# EAGLE design LPC1100_dev (EAGLE 6.2)
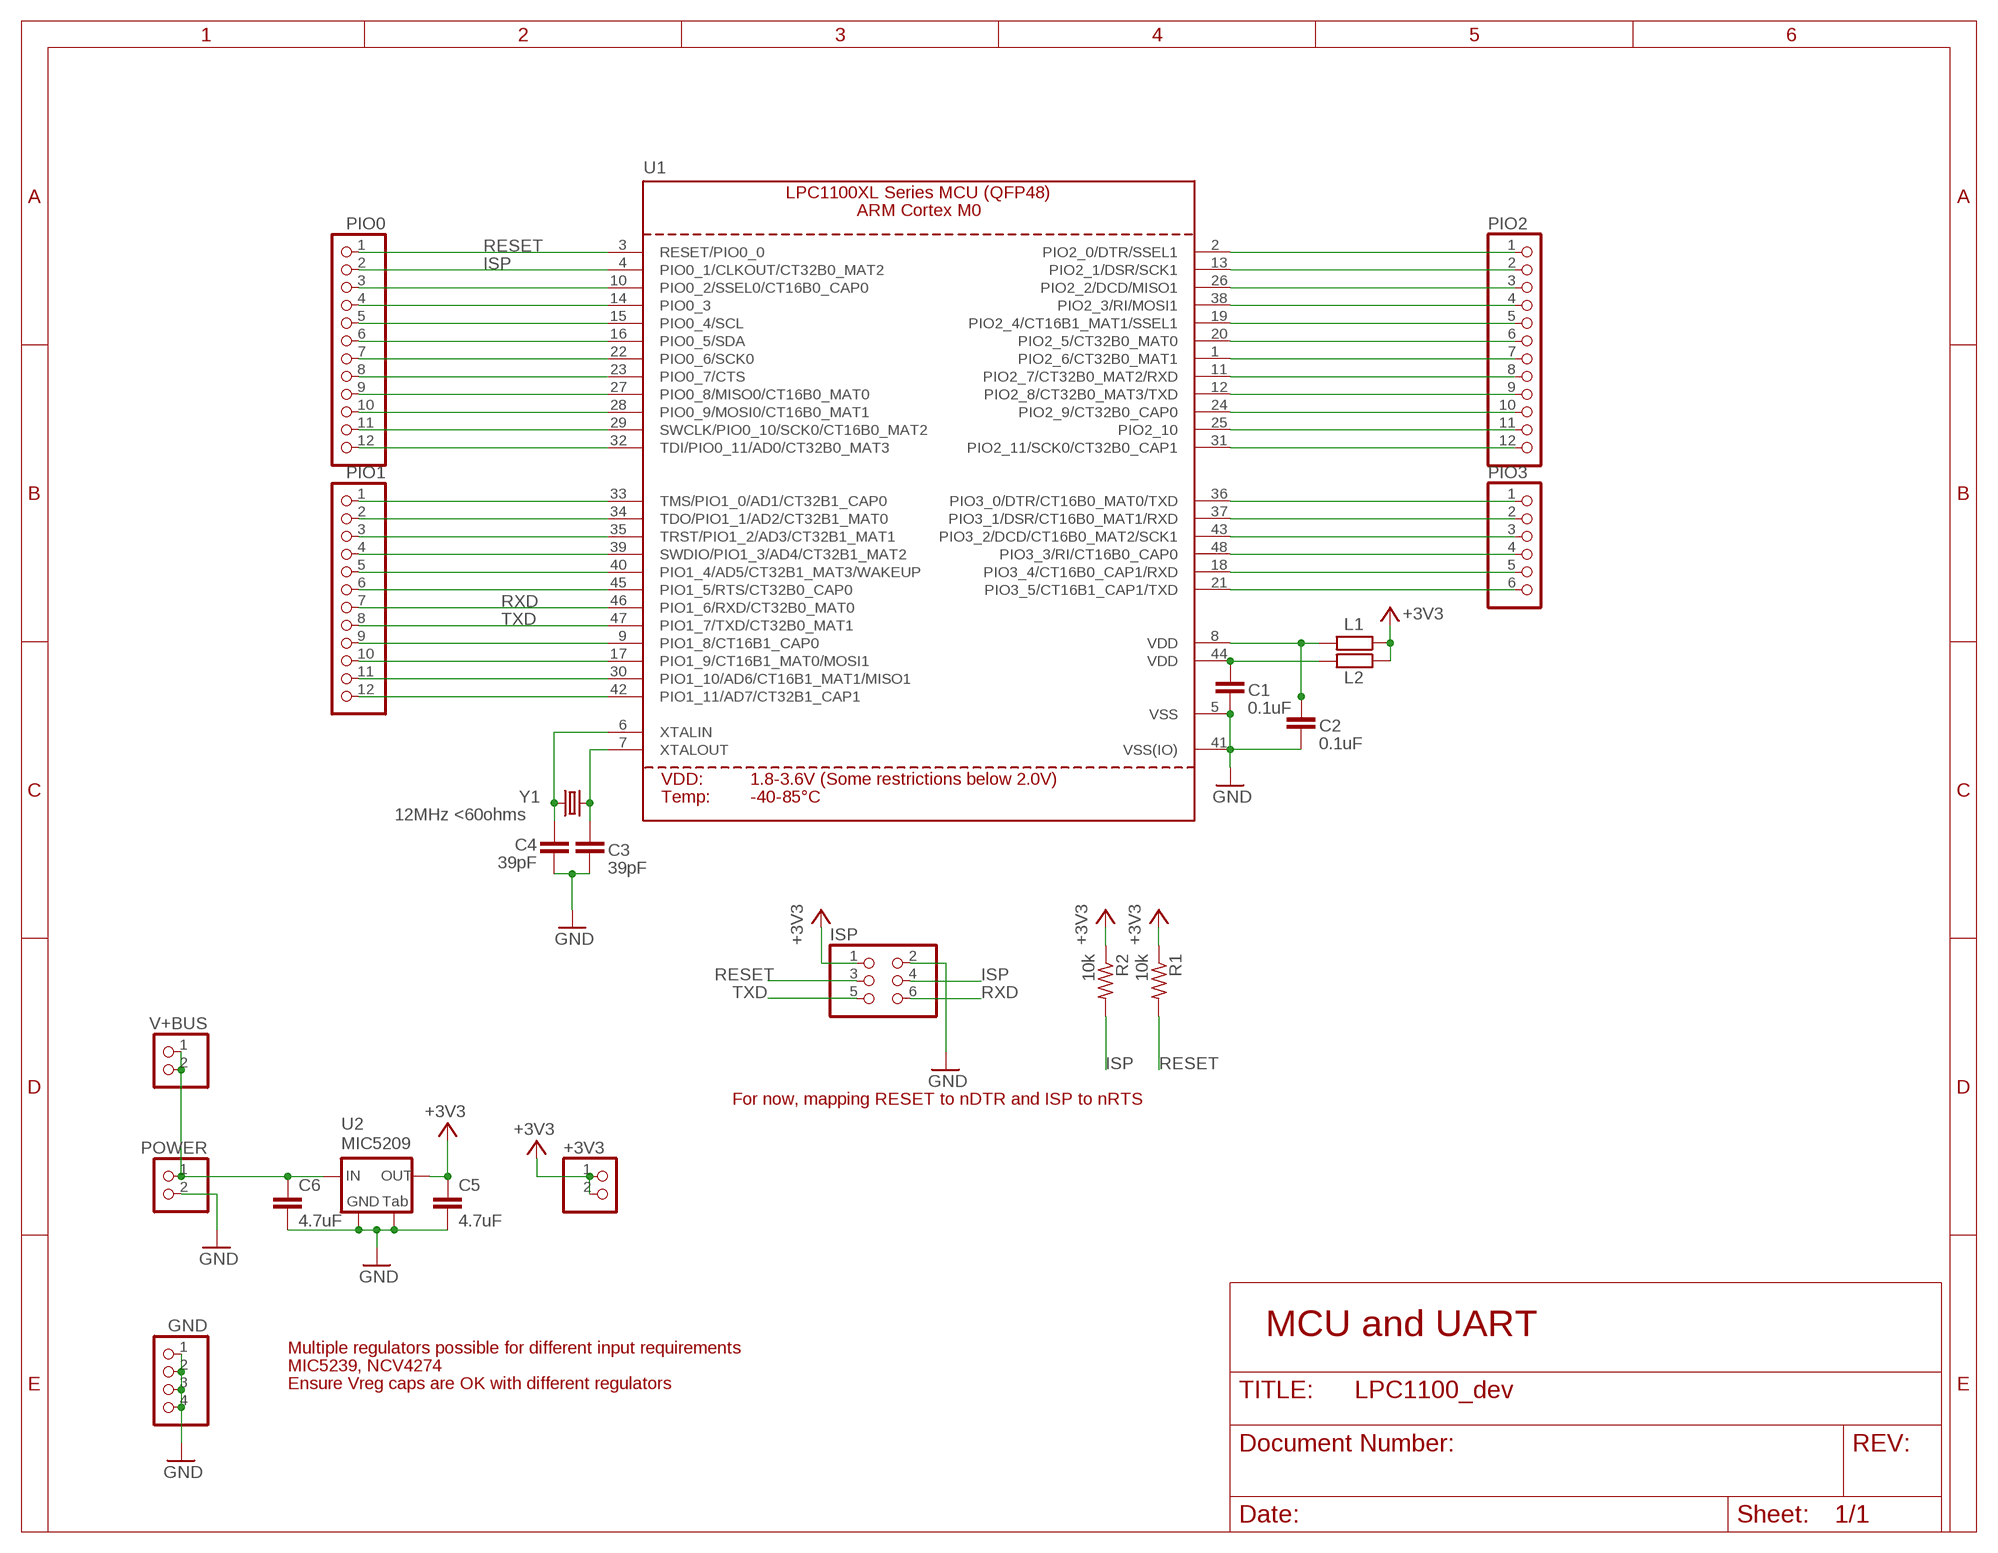
[diagram p0: schematic, sheet 1]

## Parts
+3V3  PINHD-1X2  [1X02]
C1  0.1uF  C-EUC0603  [C0603]
C2  0.1uF  C-EUC0603  [C0603]
C3  39pF  C-EUC0603  [C0603]
C4  39pF  C-EUC0603  [C0603]
C5  4.7uF  C-EUC1210  [C1210]
C6  4.7uF  C-EUC1210  [C1210]
GND  PINHD-1X4  [1X04]
ISP  PINHD-2X3  [2X03]
L1  R-EU_R0603  [R0603]
L2  R-EU_R0603  [R0603]
PIO0  PINHD-1X12  [1X12]
PIO1  PINHD-1X12  [1X12]
PIO2  PINHD-1X12  [1X12]
PIO3  PINHD-1X6  [1X06]
POWER  PINHD-1X2  [1X02]
R1  10k  R-US_R0603  [R0603]
R2  10k  R-US_R0603  [R0603]
U1  LPC1113/4/5_QFP48_XLSERIES  [LQFP48]
U2  MIC5209  MIC5239  [SOT223]
V+BUS  PINHD-1X2  [1X02]
Y1  12MHz <60ohms  CRYSTALHC49S  [HC49/S]

## Nets
+3V3: +3V3.1 +3V3.2 C5.1 ISP.1 L1.1 L2.1 R1.1 R2.1 U2.3(OUT)
CHARGE: PIO0.8 U1.23(PIO0_7/CTS)
DDS_FSYNC: PIO0.3 U1.10(PIO0_2/SSEL0/CT16B0_CAP0)
DDS_MCLK: PIO0.9 U1.27(PIO0_8/MISO0/CT16B0_MAT0)
DDS_SCLK: PIO0.11 U1.29(SWCLK/PIO0_10/SCK0/CT16B0_MAT2)
DDS_SDATA: PIO0.10 U1.28(PIO0_9/MOSI0/CT16B0_MAT1)
FAULT: PIO1.10 U1.17(PIO1_9/CT16B1_MAT0/MOSI1)
GND: C1.2 C2.2 C3.2 C4.2 C5.2 C6.2 GND.1 GND.2 GND.3 GND.4 ISP.2 POWER.2 U1.5(VSS) U1.41(VSS(IO)) U2.2(GND) U2.4(TAB)
ISP: ISP.4 PIO0.2 R2.2 U1.4(PIO0_1/CLKOUT/CT32B0_MAT2)
MEGGER_GAIN: PIO2.12 U1.31(PIO2_11/SCK0/CT32B0_CAP1)
MEGGER_I: PIO1.11 U1.30(PIO1_10/AD6/CT16B1_MAT1/MISO1)
MEGGER_V: PIO0.12 U1.32(TDI/PIO0_11/AD0/CT32B0_MAT3)
N$1: PIO0.5 U1.15(PIO0_4/SCL)
N$2: C6.1 POWER.1 U2.1(IN) V+BUS.1 V+BUS.2
N$3: PIO0.6 U1.16(PIO0_5/SDA)
N$4: PIO1.9 U1.9(PIO1_8/CT16B1_CAP0)
N$5: PIO2.1 U1.2(PIO2_0/DTR/SSEL1)
N$6: PIO2.4 U1.38(PIO2_3/RI/MOSI1)
N$7: PIO2.5 U1.19(PIO2_4/CT16B1_MAT1/SSEL1)
N$8: PIO2.10 U1.24(PIO2_9/CT32B0_CAP0)
N$9: PIO2.11 U1.25(PIO2_10)
N$10: PIO3.1 U1.36(PIO3_0/DTR/CT16B0_MAT0/TXD)
N$11: PIO3.3 U1.43(PIO3_2/DCD/CT16B0_MAT2/SCK1)
N$12: PIO3.4 U1.48(PIO3_3/RI/CT16B0_CAP0)
N$13: PIO3.5 U1.18(PIO3_4/CT16B0_CAP1/RXD)
N$14: PIO3.6 U1.21(PIO3_5/CT16B1_CAP1/TXD)
N$72: C3.1 U1.7(XTALOUT) Y1.2
N$73: C4.1 U1.6(XTALIN) Y1.1
N$118: C1.1 L2.2 U1.44(VDD)
N$119: C2.1 L1.2 U1.8(VDD)
N$121: PIO3.2 U1.37(PIO3_1/DSR/CT16B0_MAT1/RXD)
N$122: PIO2.7 U1.1(PIO2_6/CT32B0_MAT1)
N$123: PIO1.6 U1.45(PIO1_5/RTS/CT32B0_CAP0)
PEAK_RESET: PIO1.2 U1.34(TDO/PIO1_1/AD2/CT32B1_MAT0)
PHONE_MUX_DATA: PIO2.8 U1.11(PIO2_7/CT32B0_MAT2/RXD)
PHONE_MUX_LATCH: PIO2.9 U1.12(PIO2_8/CT32B0_MAT3/TXD)
PHONE_MUX_OE: PIO0.4 U1.14(PIO0_3)
PHONE_MUX_SCK: PIO2.2 U1.13(PIO2_1/DSR/SCK1)
RESET: ISP.3 PIO0.1 R1.2 U1.3(RESET/PIO0_0)
RXD: ISP.6 PIO1.7 U1.46(PIO1_6/RXD/CT32B0_MAT0)
TXD: ISP.5 PIO1.8 U1.47(PIO1_7/TXD/CT32B0_MAT1)
VR_POL: PIO1.12 U1.42(PIO1_11/AD7/CT32B1_CAP1)
VX_POL: PIO1.1 U1.33(TMS/PIO1_0/AD1/CT32B1_CAP0)
Z_DC_SELECT: PIO2.3 U1.26(PIO2_2/DCD/MISO1)
Z_I: PIO1.4 U1.39(SWDIO/PIO1_3/AD4/CT32B1_MAT2)
Z_I_GAIN: PIO1.5 U1.40(PIO1_4/AD5/CT32B1_MAT3/WAKEUP)
Z_MEG_MUX: PIO0.7 U1.22(PIO0_6/SCK0)
Z_SHDN: PIO2.6 U1.20(PIO2_5/CT32B0_MAT0)
Z_V: PIO1.3 U1.35(TRST/PIO1_2/AD3/CT32B1_MAT1)

## Notes on the sheet
- For now, mapping RESET to nDTR and ISP to nRTS
- MCU and UART
- Multiple regulators possible for different input requirements
- MIC5239, NCV4274
- Ensure Vreg caps are OK with different regulators

## Library data of the parts
+3V3 POWER V+BUS = pinhead:PINHD-1X2: PIN HEADER
C1-C6 = rcl:C-EU: CAPACITOR, European symbol
GND = pinhead:PINHD-1X4: PIN HEADER
ISP = pinhead:PINHD-2X3: PIN HEADER
L1 L2 = rcl:R-EU_: RESISTOR, European symbol
PIO0 PIO1 PIO2 = pinhead:PINHD-1X12: PIN HEADER
PIO3 = pinhead:PINHD-1X6: PIN HEADER
R1 R2 = rcl:R-US_: RESISTOR, American symbol
U1 = microbuilder:LPC1113/4/5_QFP48_XLSERIES: LPC1113/4/5 ARM Cortex M0 MCU (50MHz) - XL Series (FBD48/3x3) LPC1115FBD48/303: Max Frequency: 50MHz Flash: 64kB SRAM: 8kB ADC: 10-bit
U2 = TBParts:MIC5239: Micrel MIC5293 LDO. 500mA output, fixed V out. Small bypass caps.
Y1 = crystal:CRYSTAL: CRYSTAL; OC_FARNELL: 1667008; OC_NEWARK: unknown

## Board
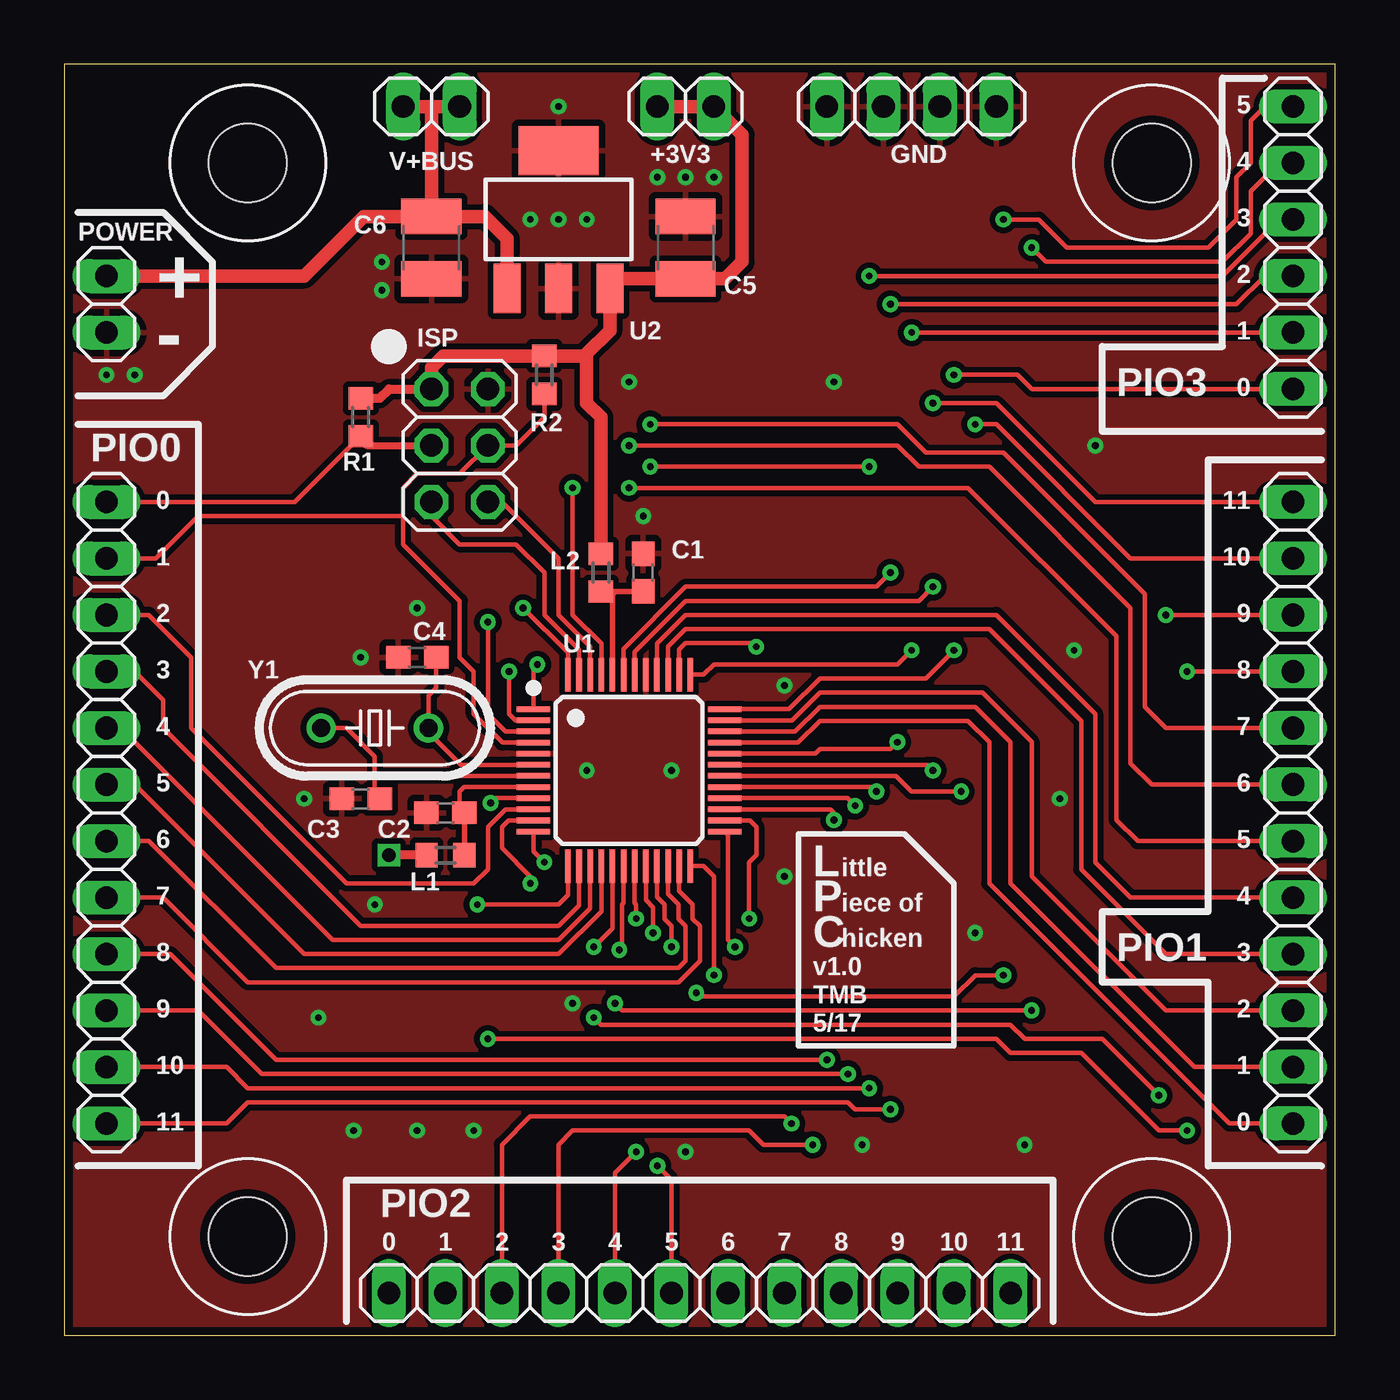
[diagram p1: board, top side]
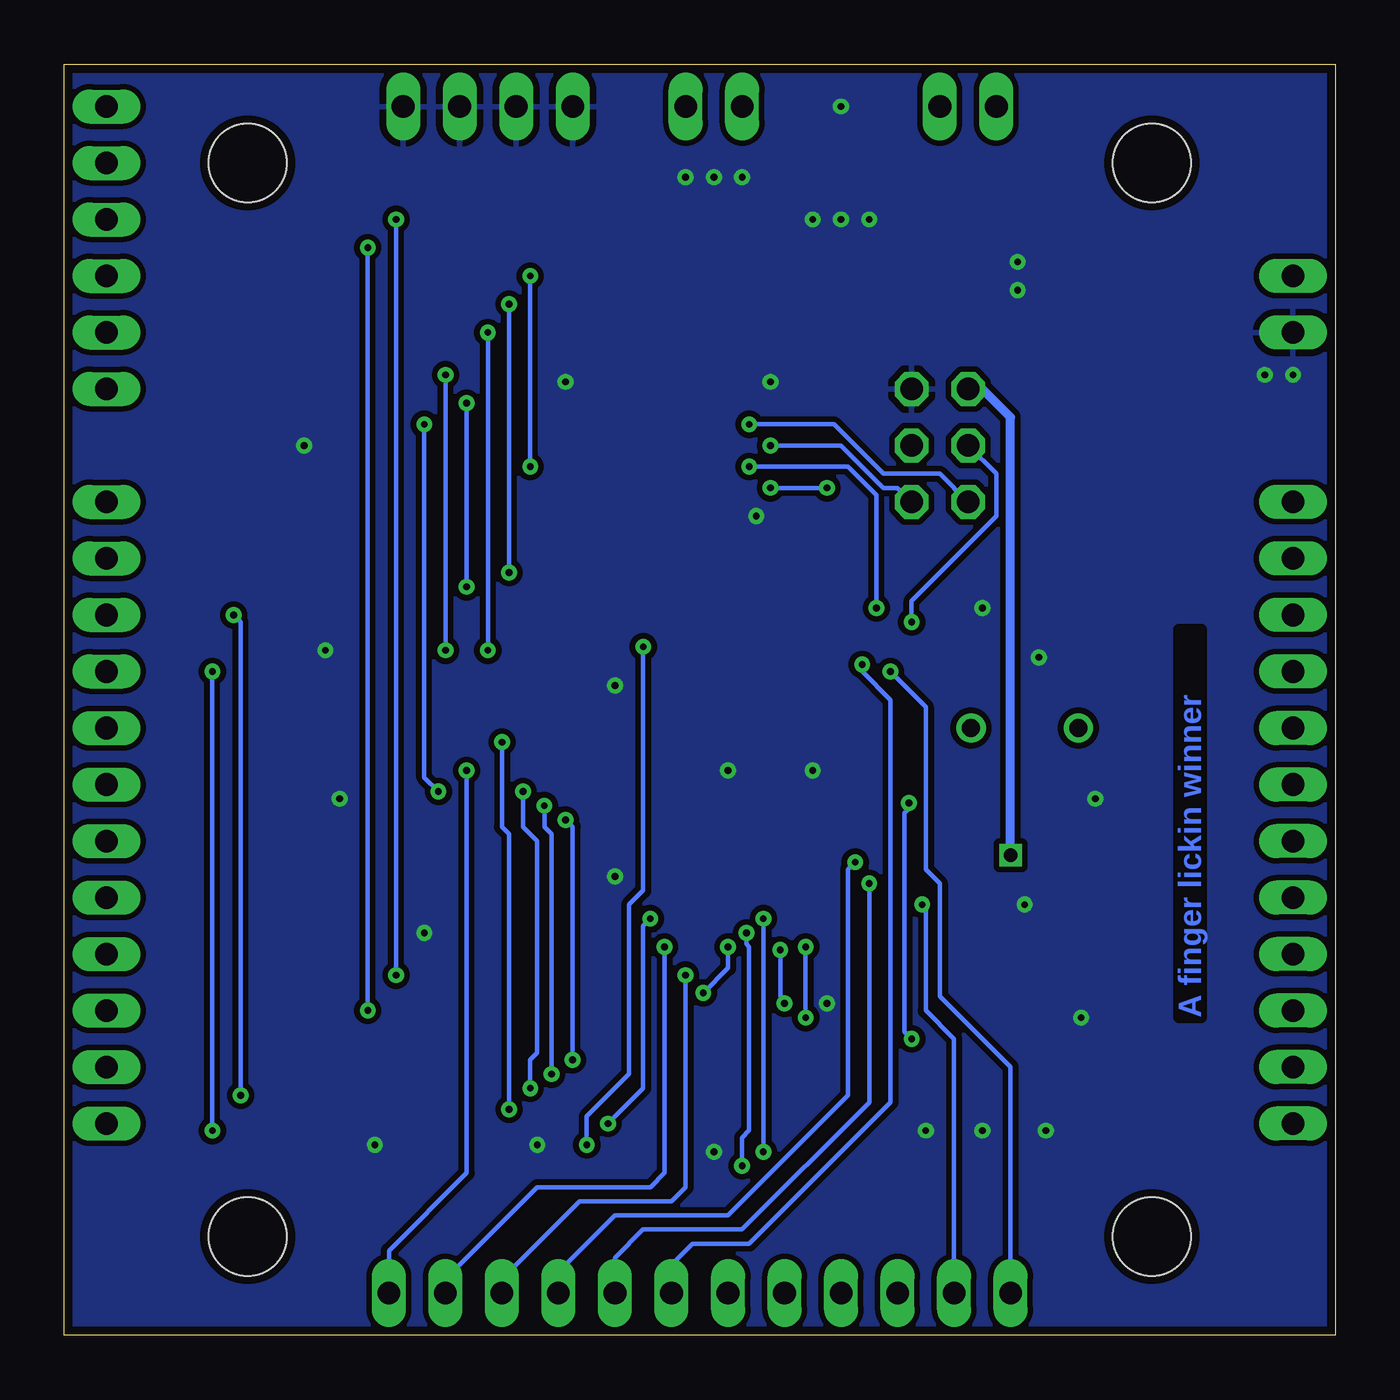
[diagram p2: board, bottom side, seen from below]

Size 57.15 x 57.15 mm. Coordinates in mm from the lower left corner, seen from the top.
Outline: 0,0 57.15,0 57.15,57.15 0,57.15 0,0
Copper layers (1*16): Top 0.035mm / dielectric 1.5mm / Bottom 0.035mm
Design rules: minimum track width 6mil, minimum drill 12mil, track to track 6mil, track to pad 6mil, pad to pad 6mil, via to via 6mil, smd to smd 0mil, copper to edge 15mil, drill to drill 20mil, minimum pad ring 10mil, minimum via ring 8mil, stop-mask expansion 1mil, vias tented up to drill 0mil, thermal gap 12mil

### Footprints (pad centres in the part's own frame; a part is rotated, then mirrored left to right if it is on the bottom)
1X02 = drill 1.016 long: 1 -1.27,0; 2 1.27,0
C0603 = smd 1.1 x 1: 1 -0.85,0; 2 0.85,0
C1210 = smd 1.6 x 2.7: 1 -1.4,0; 2 1.4,0
1X04 = drill 1.016 long: 1 -3.81,0; 2 -1.27,0; 3 1.27,0; 4 3.81,0
2X03 = drill 1.016 octagon: 1 -2.54,-1.27; 2 -2.54,1.27; 3 0,-1.27; 4 0,1.27; 5 2.54,-1.27; 6 2.54,1.27
R0603 = smd 1 x 1.1: 1 -0.85,0; 2 0.85,0
1X12 = drill 1.016 long: 1 -13.97,0; 2 -11.43,0; 3 -8.89,0; 4 -6.35,0; 5 -3.81,0; 6 -1.27,0; 7 1.27,0; 8 3.81,0; 9 6.35,0; 10 8.89,0; 11 11.43,0; 12 13.97,0
1X06 = drill 1.016 long: 1 -6.35,0; 2 -3.81,0; 3 -1.27,0; 4 1.27,0; 5 3.81,0; 6 6.35,0
LQFP48 = smd 1.5 x 0.25: 1 -4.3,2.75; 2 -4.3,2.25; 3 -4.3,1.75; 4 -4.3,1.25; 5 -4.3,0.75; 6 -4.3,0.25; 7 -4.3,-0.25; 8 -4.3,-0.75; 9 -4.3,-1.25; 10 -4.3,-1.75; 11 -4.3,-2.25; 12 -4.3,-2.75; 25 4.3,-2.75; 26 4.3,-2.25; 27 4.3,-1.75; 28 4.3,-1.25; 29 4.3,-0.75; 30 4.3,-0.25; 31 4.3,0.25; 32 4.3,0.75; 33 4.3,1.25; 34 4.3,1.75; 35 4.3,2.25; 36 4.3,2.75 | smd 0.25 x 1.5: 13 -2.75,-4.3; 14 -2.25,-4.3; 15 -1.75,-4.3; 16 -1.25,-4.3; 17 -0.75,-4.3; 18 -0.25,-4.3; 19 0.25,-4.3; 20 0.75,-4.3; 21 1.25,-4.3; 22 1.75,-4.3; 23 2.25,-4.3; 24 2.75,-4.3; 37 2.75,4.3; 38 2.25,4.3; 39 1.75,4.3; 40 1.25,4.3; 41 0.75,4.3; 42 0.25,4.3; 43 -0.25,4.3; 44 -0.75,4.3; 45 -1.25,4.3; 46 -1.75,4.3; 47 -2.25,4.3; 48 -2.75,4.3
SOT223 = smd 1.219 x 2.235: 1 -2.311,-3.099; 2 0,-3.099; 3 2.311,-3.099 | smd 3.6 x 2.2: 4 0,3.099
6X32_HOLE = hole 3.5: 0,0
HC49/S = drill 0.813: 1 -2.413,0; 2 2.413,0

### Placement (x,y rotation side)
+3V3  27.94,55.24 0 top
C1  26.04,34.29 90 top
C2  17.14,23.5 180 top
C3  13.34,24.13 180 top
C4  15.88,30.48 180 top
C5  27.94,48.9 90 top
C6  16.51,48.9 270 top
GND  38.1,55.24 180 top
ISP  17.78,40.01 270 top
L1  17.14,21.59 0 top
L2  24.13,34.29 270 top
PIO0  1.91,23.5 270 top
PIO1  55.24,23.5 90 top
PIO2  28.57,1.91 0 top
PIO3  55.24,48.9 90 top
POWER  1.91,46.35 270 top
R1  13.34,41.27 270 top
R2  21.59,43.18 270 top
U1  25.4,25.4 0 top
U2  22.23,50.16 0 top
U$1  [6X32_HOLE]  8.26,4.45 0 top
U$2  [6X32_HOLE]  48.9,4.45 0 top
U$3  [6X32_HOLE]  8.26,52.7 0 top
U$4  [6X32_HOLE]  48.9,52.7 0 top
V+BUS  16.51,55.24 0 top
Y1  13.97,27.3 180 top

### Tracks (layer width: path | path; a pad name or v marks a point on that pad's centre or on a via)
+3V3  (via drill 0.6)
  Top 0.406: L1.1 v14.61,21.59 | R1.1 14.19,42.12 14.61,42.55 ISP.1
  Top 0.61: L2.1 24.13,41.27 23.5,41.91 23.5,44.13 | +3V3.1 +3V3.2 30.48,53.98 30.48,48.26 29.71,47.49 C5.1 24.96,47.49 U2.3 24.54,45.17 23.5,44.13 | 23.5,44.13 23.39,44.03 R2.1 17.04,44.03 16.51,43.5 ISP.1
  Bottom 0.406: v14.61,21.59 14.61,41.27 15.88,42.55 ISP.1
CHARGE
  Top 0.203: U1.23 27.65,19.98 28.26,19.37 28.26,18.73 28.57,18.41 28.57,16.83 27.62,15.88 8.26,15.88 4.45,19.68 PIO0.8
DDS_FSYNC
  Top 0.203: U1.10 19.84,23.65 19.05,22.86 19.05,20.95 18.41,20.32 12.7,20.32 5.71,27.3 5.71,30.48 3.81,32.38 PIO0.3
DDS_MCLK  (via drill 0.3)
  Top 0.203: U1.27 34.45,23.65 34.61,23.5 v34.61,23.18 | PIO0.9 4.76,17.14 9.53,12.38 v34.29,12.38
  Bottom 0.203: v34.29,12.38 34.29,22.86 v34.61,23.18
DDS_SCLK  (via drill 0.3)
  Top 0.203: U1.29 36.31,24.65 v36.51,24.45 | PIO0.11 7.3,12.06 8.26,11.11 v36.2,11.11
  Bottom 0.203: v36.51,24.45 36.51,22.86 35.88,22.23 35.88,12.7 36.2,12.38 v36.2,11.11
DDS_SDATA  (via drill 0.3)
  Top 0.203: U1.28 35.22,24.15 v35.56,23.81 | PIO0.10 6.03,14.61 8.89,11.75 v35.24,11.75
  Bottom 0.203: v35.56,23.81 35.56,22.86 35.24,22.54 v35.24,11.75
FAULT  (via drill 0.3)
  Top 0.203: U1.17 24.65,18.3 v23.81,17.46 | v23.81,14.29 24.13,13.97 42.55,13.97 43.18,13.34 46.67,13.34 v49.21,10.79 | v49.53,32.38 PIO1.10
  Bottom 0.203: v23.81,17.46 v23.81,14.29 | v49.21,10.79 49.21,32.07 v49.53,32.38
GND  (via drill 0.3)
  other vias: 27.3,25.4 23.5,25.4 15.88,32.7 13.34,30.48 10.79,24.13 26.04,36.83 22.23,55.24 22.23,50.16 27.94,52.07 14.29,48.26 23.5,50.16 20.95,50.16 26.67,52.07 29.21,52.07 14.29,46.99 32.38,29.21 18.41,9.21 15.88,9.21 11.43,14.29 27.94,8.26 35.88,8.57 32.38,20.64 40.96,18.1 43.18,8.57 46.35,40.01 44.77,24.13 25.4,42.86 34.61,42.86 1.91,43.18 3.17,43.18 13.97,19.37 22.86,14.92 13.02,9.21 45.4,30.8
  pour Top (isolate 0.254, rank 3): 0,0 0,57.15 57.15,57.15 57.15,0
  pour Bottom (isolate 0.254): 0,0 0,57.15 57.15,57.15 57.15,0
ISP
  Top 0.203: U1.4 19.7,26.65 18.41,27.94 18.41,29.84 17.78,30.48 17.78,33.02 15.24,35.56 15.24,36.83 | 15.24,36.83 15.24,38.1 15.88,38.73 17.78,38.73 ISP.4 20.32,40.01 21.59,41.27 R2.2 | PIO0.2 4.13,34.92 6.03,36.83 15.24,36.83
MEGGER_GAIN  (via drill 0.3)
  Top 0.203: U1.31 38.8,25.65 v39.05,25.4
  Bottom 0.203: v39.05,25.4 39.05,7.3 42.55,3.81 PIO2.12
MEGGER_I  (via drill 0.3)
  Top 0.203: U1.30 37.4,25.15 38.1,24.45 v40.32,24.45 | v40.96,40.96 41.91,40.96 47.94,34.92 PIO1.11
  Bottom 0.203: v40.32,24.45 40.96,25.08 v40.96,40.96
MEGGER_V  (via drill 0.3)
  Top 0.203: U1.32 33.77,26.15 33.97,26.35 37.15,26.35 v37.47,26.67 | PIO0.12 7.3,9.53 8.26,10.48 35.24,10.48 35.56,10.16 v37.15,10.16
  Bottom 0.203: v37.47,26.67 37.47,22.86 37.15,22.54 v37.15,10.16
N$1
  Top 0.203: U1.15 23.65,19.2 22.23,17.78 12.06,17.78 2.54,27.3 PIO0.5
N$2
  Top 0.61: V+BUS.1 16.51,55.24 | C6.1 18.92,50.3 19.91,49.3 U2.1 | POWER.1 10.79,47.62 13.46,50.3 C6.1 | V+BUS.2 16.51,55.24 | 16.51,55.24 C6.1
N$3
  Top 0.203: U1.16 24.15,19.07 22.23,17.14 10.79,17.14 3.17,24.77 PIO0.6
N$4  (via drill 0.3)
  Top 0.203: U1.9 19.39,24.15 v19.18,23.94 | v19.05,13.34 41.91,13.34 42.55,12.7 45.72,12.7 49.21,9.21 v50.48,9.21 | v50.48,29.84 PIO1.9
  Bottom 0.203: v19.18,23.94 19.18,23.69 19.37,23.5 19.37,13.65 v19.05,13.34 | v50.48,9.21 v50.48,29.84
N$5  (via drill 0.3)
  Top 0.203: U1.2 20.29,27.65 20,27.94 v20,29.84
  Bottom 0.203: v20,29.84 18.41,28.26 18.41,20.95 17.78,20.32 17.78,15.24 14.61,12.06 PIO2.1
N$6  (via drill 0.3)
  Top 0.203: U1.38 27.65,30.82 27.94,31.11 30.96,31.11 v31.11,30.96 | v33.66,8.57 31.43,8.57 30.8,9.21 22.86,9.21 22.23,8.57 PIO2.4
  Bottom 0.203: v31.11,30.96 31.11,20 31.75,19.37 31.75,11.75 33.66,9.84 v33.66,8.57
N$7  (via drill 0.3)
  Top 0.203: U1.19 25.65,19.43 25.72,19.37 v25.72,18.73 | v25.72,8.26 24.77,7.3 PIO2.5
  Bottom 0.203: v25.72,18.73 v25.72,8.26
N$8  (via drill 0.3)
  Top 0.203: U1.24 28.75,21.1 29.21,20.64 v29.21,16.19
  Bottom 0.203: v29.21,16.19 29.21,6.67 29.84,6.03 33.97,6.03 37.47,2.54 PIO2.10
N$9  (via drill 0.3)
  Top 0.203: U1.25 29.84,22.5 29.84,17.78 v30.16,17.46
  Bottom 0.203: v30.16,17.46 30.16,7.3 30.8,6.67 35.88,6.67 40.01,2.54 PIO2.11
N$10  (via drill 0.3)
  Top 0.203: U1.36 32.59,28.15 33.97,29.53 38.73,29.53 v40.01,30.8 | PIO3.1 43.5,42.55 42.86,43.18 v40.01,43.18
  Bottom 0.203: v40.01,30.8 v40.01,43.18
N$11  (via drill 0.3)
  Top 0.203: U1.43 25.15,30.86 27.94,33.66 36.51,33.66 v37.15,34.29 | v37.15,46.35 52.7,46.35 53.98,47.62 PIO3.3
  Bottom 0.203: v37.15,34.29 v37.15,46.35
N$12  (via drill 0.3)
  Top 0.203: U1.48 22.65,30.69 v20.64,32.7 | v26.35,39.05 v36.2,39.05 | v36.2,47.62 52.07,47.62 54.61,50.16 PIO3.4
  Bottom 0.203: v20.64,32.7 20.64,37.78 21.91,39.05 v26.35,39.05 | v36.2,39.05 v36.2,47.62
N$13  (via drill 0.3)
  Top 0.203: U1.18 25.15,19.43 25.08,19.37 25.08,17.46 v24.96,17.34 | v24.77,14.92 25.08,14.61 v43.5,14.61 | v43.5,48.9 44.13,48.26 52.07,48.26 53.34,49.53 53.34,51.44 54.61,52.7 PIO3.5
  Bottom 0.203: v24.96,17.34 24.96,15.11 v24.77,14.92 | v43.5,14.61 v43.5,48.9
N$14  (via drill 0.3)
  Top 0.203: U1.21 26.65,19.7 26.99,19.37 26.99,18.73 27.3,18.41 v27.3,17.46 | v28.42,15.4 28.57,15.24 40.01,15.24 40.96,16.19 v42.23,16.19 | v42.23,50.16 43.81,50.16 45.09,48.9 51.44,48.9 52.7,50.16 52.7,52.07 53.34,52.7 53.34,54.61 53.98,55.24 PIO3.6
  Bottom 0.203: v27.3,17.46 27.3,16.51 v28.42,15.4 | v42.23,16.19 v42.23,50.16
N$72
  Top 0.152: 13.97,24.34 C3.1
  Top 0.203: Y1.2 12.7,27.3 13.97,26.04 13.97,25.15 | 13.97,25.15 13.97,24.34 | U1.7 13.97,25.15
N$73
  Top 0.203: U1.6 17.85,25.65 16.38,27.11 Y1.1 16.38,28.77 16.73,29.11 C4.1
N$118
  Top 0.254: C1.1 24.77,33.44 | 24.77,33.44 L2.2 | U1.44 24.65,33.33 24.77,33.44
N$119
  Top 0.203: U1.8 17.98,24.65 17.78,24.45 17.78,23.71 C2.1
  Top 0.254: L1.2 C2.1
N$121  (via drill 0.3)
  Top 0.203: U1.37 28.75,29.7 29.21,30.16 37.47,30.16 v38.1,30.8 | v38.1,45.09 PIO3.2
  Bottom 0.203: v38.1,30.8 v38.1,45.09
N$122  (via drill 0.3)
  Top 0.152: U1.1 20.75,28.15
  Top 0.203: U1.1 21.1,29.99 v21.27,30.16
  Bottom 0.203: v21.27,30.16 21.27,29.84 20,28.57 20,10.48 26.35,4.13 28.89,4.13 29.84,3.17 PIO2.7
N$123  (via drill 0.3)
  Top 0.203: U1.45 24.15,31.09 22.86,32.38 v22.86,38.1 | v25.4,38.1 40.64,38.1 47.31,31.43 47.31,23.18 48.26,22.23 PIO1.6
  Bottom 0.203: v22.86,38.1 v25.4,38.1
PEAK_RESET
  Top 0.203: U1.34 32.87,27.15 33.97,28.26 40.96,28.26 42.55,26.67 42.55,20.32 50.8,12.06 PIO1.2
PHONE_MUX_DATA  (via drill 0.3)
  Top 0.203: U1.11 19.98,23.15 19.68,22.86 19.68,21.91 20.95,20.64 v20.95,20.32
  Bottom 0.203: v20.95,20.32 20.95,10.48 26.67,4.76 31.11,4.76 32.38,3.49 PIO2.8
PHONE_MUX_LATCH  (via drill 0.3)
  Top 0.203: U1.12 21.1,21.76 v21.59,21.27
  Bottom 0.203: v21.59,21.27 21.91,20.95 21.91,10.79 27.3,5.4 32.38,5.4 34.92,2.86 PIO2.9
PHONE_MUX_OE
  Top 0.203: U1.14 23.15,19.34 22.23,18.41 13.34,18.41 4.45,27.3 4.45,28.57 3.17,29.84 PIO0.4
PHONE_MUX_SCK  (via drill 0.3)
  Top 0.203: U1.13 22.65,19.79 22.23,19.37 v18.57,19.37
  Bottom 0.203: v18.57,19.37 18.41,19.21 18.41,14.61 17.14,13.34 PIO2.2
RESET  (via drill 0.3)
  Top 0.203: U1.3 19.84,27.15 19.05,27.94 v19.05,32.07 | PIO0.1 10.38,37.47 R1.2
  Top 0.305: R1.2 arc90 13.65,40.01 ISP.3
  Bottom 0.203: v19.05,32.07 19.05,33.02 15.24,36.83 15.24,38.73 ISP.3
RXD  (via drill 0.3)
  Top 0.203: U1.46 23.65,30.96 22.23,32.38 22.23,34.92 19.68,37.47 ISP.6 | PIO1.7 48.9,24.77 47.94,25.72 47.94,32.7 41.59,39.05 38.42,39.05 37.47,40.01 v25.4,40.01
  Bottom 0.203: v25.4,40.01 22.23,40.01 20.32,38.1 19.68,38.1 ISP.6
TXD  (via drill 0.3)
  Top 0.203: U1.47 23.15,30.82 21.59,32.38 21.59,34.29 20.32,35.56 17.78,35.56 16.51,36.83 ISP.5 | PIO1.8 49.53,27.3 48.58,28.26 48.58,33.34 42.23,39.69 38.73,39.69 37.47,40.96 v26.35,40.96
  Bottom 0.203: v26.35,40.96 22.54,40.96 20.32,38.73 17.78,38.73 ISP.5
VR_POL  (via drill 0.3)
  Top 0.203: U1.42 25.65,30.73 27.94,33.02 38.42,33.02 v39.05,33.66 | v39.05,41.91 41.91,41.91 46.35,37.47 PIO1.12
  Bottom 0.203: v39.05,33.66 v39.05,41.91
VX_POL
  Top 0.203: U1.33 33,26.65 33.97,27.62 40.64,27.62 41.59,26.67 41.59,20.32 52.39,9.53 PIO1.1
Z_DC_SELECT  (via drill 0.3)
  Top 0.203: U1.26 30.82,23.15 31.11,22.86 31.11,21.59 30.8,21.27 v30.8,18.73 | v32.7,9.53 32.38,9.84 20.95,9.84 19.68,8.57 PIO2.3
  Bottom 0.203: v30.8,18.73 31.11,18.41 31.11,11.11 v32.7,9.53
Z_I
  Top 0.203: U1.39 27.15,30.96 27.94,31.75 41.59,31.75 45.72,27.62 45.72,20.95 49.53,17.14 PIO1.4
Z_I_GAIN
  Top 0.203: U1.40 26.65,31.09 27.94,32.38 41.91,32.38 46.35,27.94 46.35,21.27 47.94,19.68 PIO1.5
Z_MEG_MUX
  Top 0.203: U1.22 27.15,19.84 27.62,19.37 27.62,18.73 27.94,18.41 27.94,16.83 27.62,16.51 9.53,16.51 3.81,22.23 PIO0.7
Z_SHDN  (via drill 0.3)
  Top 0.203: U1.20 26.15,19.57 26.48,19.24 v26.48,18.1 | v26.67,7.62 27.3,6.99 PIO2.6
  Bottom 0.203: v26.67,7.62 26.67,8.89 26.35,9.21 26.35,17.46 26.48,17.59 v26.48,18.1
Z_V
  Top 0.203: U1.35 32.73,27.65 33.97,28.89 41.27,28.89 43.5,26.67 43.5,20.64 49.53,14.61 PIO1.3

### Text on the board
Bottom: A finger lickin winner
tPlace: 5 | 4 | 3 | 2 | + | 1 | - | 0 | 0 | 11 | 1 | 10 | 2 | 9 | 3 | 8 | 4 | 7 | 5 | 6 | 6 | 5 | L | ittle | 7 | P | iece of | 4 | 8 | C | hicken | 3 | v1.0 | TMB | 9 | 5/17 | 2 | 10 | 1 | 11 | 0 | 0 | 1 | 2 | 3 | 4 | 5 | 6 | 7 | 8 | 9 | 10 | 11